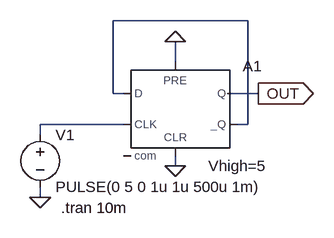
[diagram p0: schematic DigitalTest1.asc]
DigitalTest1.asc, the LTspice schematic file:
Version 4
SHEET 1 880 680
WIRE 336 -48 128 -48
WIRE 224 16 224 -16
WIRE 128 64 128 -48
WIRE 144 64 128 64
WIRE 352 64 304 64
WIRE 144 112 16 112
WIRE 336 112 336 -48
WIRE 336 112 320 112
WIRE 16 128 16 112
WIRE 224 176 224 160
WIRE 16 224 16 208
FLAG 16 224 0
FLAG 224 176 0
FLAG 224 -16 0
FLAG 352 64 OUT
IOPIN 352 64 Out
SYMBOL voltage 16 112 R0
WINDOW 123 0 0 Left 0
WINDOW 39 0 0 Left 0
SYMATTR InstName V1
SYMATTR Value PULSE(0 5 0 1u 1u 500u 1m)
SYMBOL Digital\\dflop 224 16 R0
WINDOW 39 51 160 Left 2
SYMATTR InstName A1
SYMATTR SpiceLine Vhigh=5
TEXT 48 240 Left 2 !.tran 10m

The netlist it stands for:
* DigitalTest1.asc
V1 N002 0 PULSE(0 5 0 1u 1u 500u 1m)
A1 N001 0 N002 0 0 N001 OUT 0 DFLOP Vhigh=5
.tran 10m
.backanno
.end